# EAGLE design schematic (EAGLE 7.5.0)
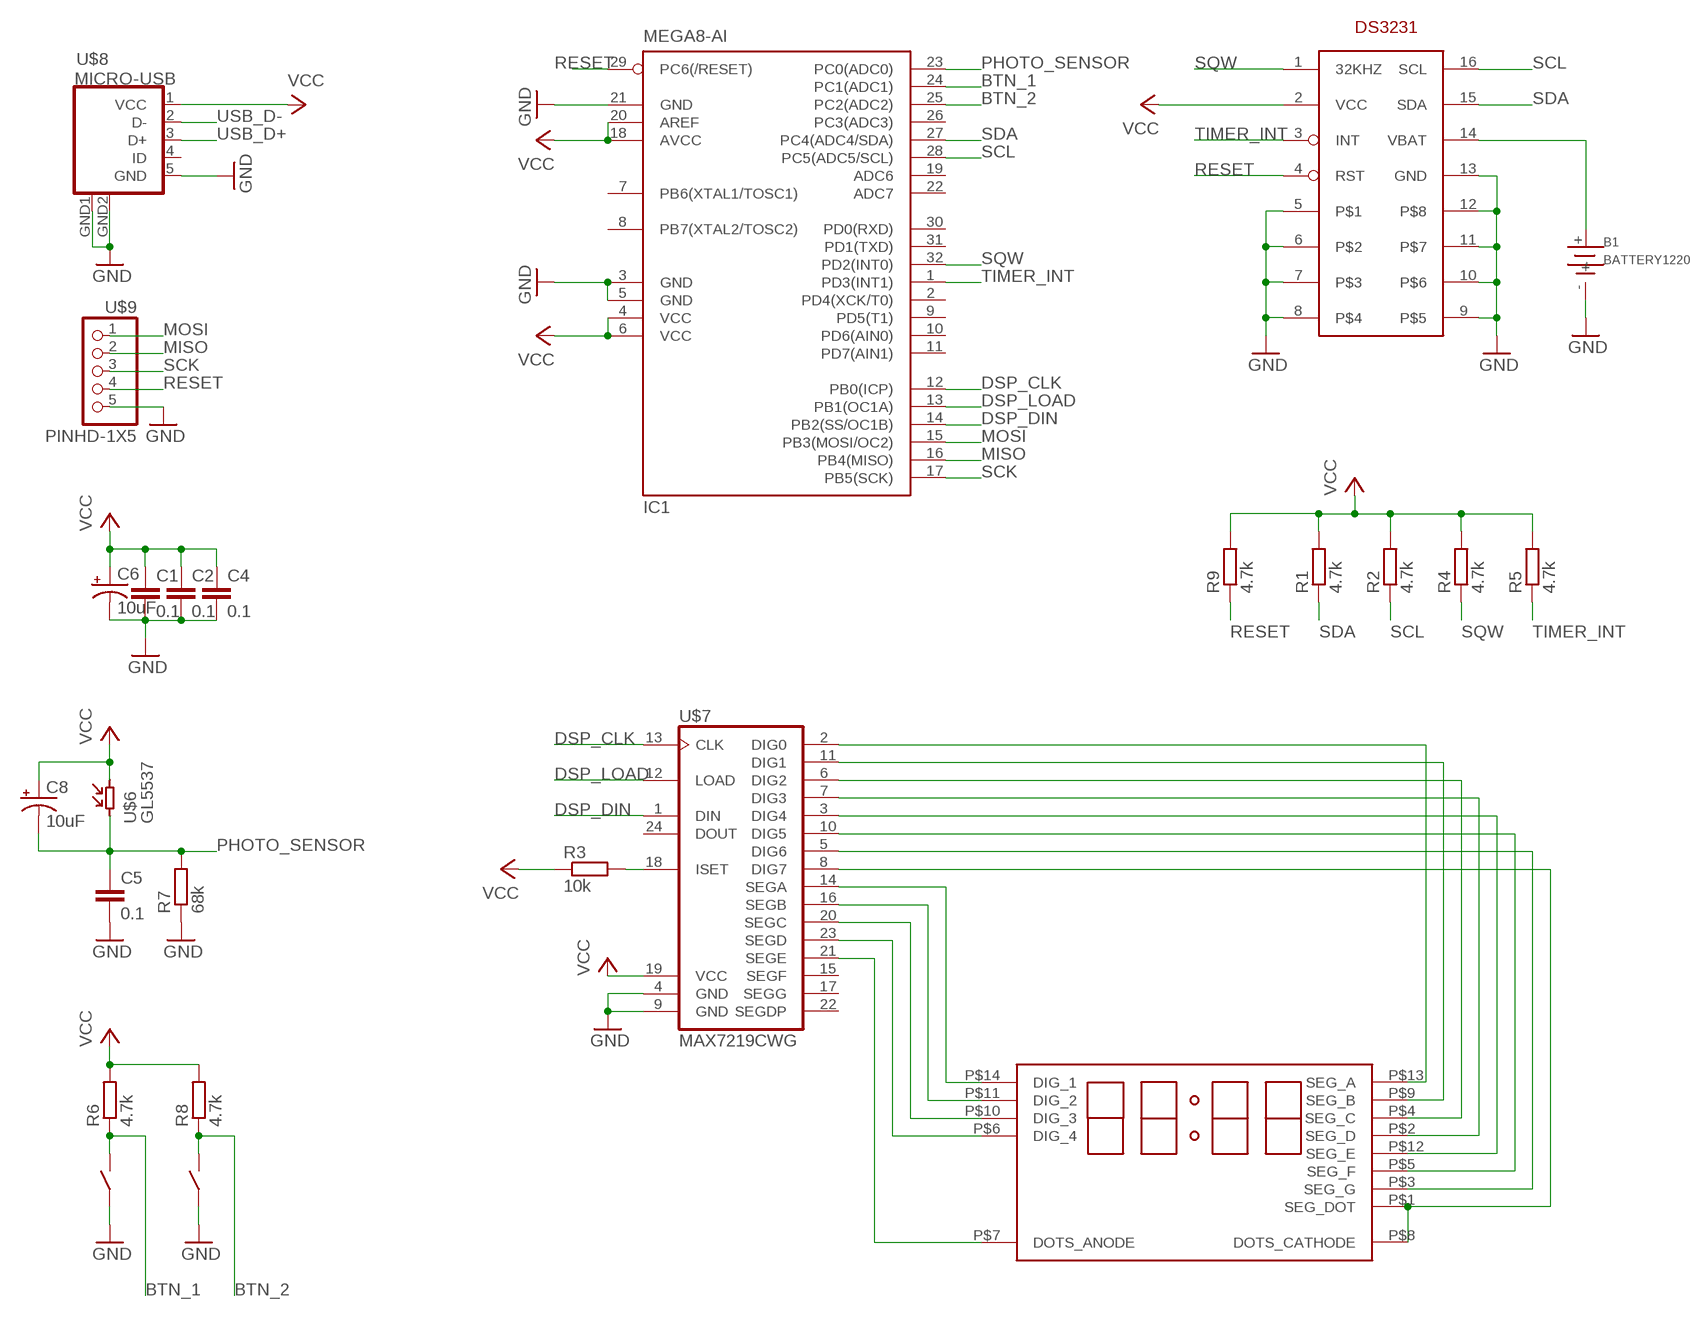
[diagram p0: schematic, sheet 1]

## Parts
B1  BATTERY1220  [1220-SMD]
C1  0.1  C-EUC0805  [C0805]
C2  0.1  C-EUC0805  [C0805]
C4  0.1  C-EUC0805  [C0805]
C5  0.1  C-EUC0805  [C0805]
C6  10uF  10UF-16V-10%(TANT)  [EIA3216]
C8  10uF  10UF-16V-10%(TANT)  [EIA3216]
IC1  MEGA8-AI  [TQFP32-08]
R1  4.7k  R-EU_R0805  [R0805]
R2  4.7k  R-EU_R0805  [R0805]
R3  10k  R-EU_R0805  [R0805]
R4  4.7k  R-EU_R0805  [R0805]
R5  4.7k  R-EU_R0805  [R0805]
R6  4.7k  R-EU_R0805  [R0805]
R7  68k  R-EU_R0805  [R0805]
R8  4.7k  R-EU_R0805  [R0805]
R9  4.7k  R-EU_R0805  [R0805]
U$1  LBT8402BW  [LBT8402]
U$2  DS3231WIDE  [SO16W]
U$3  IT1188E  [IT1188E]
U$4  IT1188E  [IT1188E]
U$6  GL5537  [GL55]
U$7  MAX7219CWG  [SO24L]
U$8  MICRO-USB  [MICRO-USB]
U$9  PINHD-1X5  [PLL1.27-1X5]

## Nets
BTN_1: IC1.24(PC1(ADC1)) R6.1 U$3.4
BTN_2: IC1.25(PC2(ADC2)) R8.1 U$4.4
DIG_1: U$1.P$14(DIG_1) U$7.14(SEGA)
DSP_CLK: IC1.12(PB0(ICP)) U$7.13(CLK)
DSP_DIN: IC1.14(PB2(SS/OC1B)) U$7.1(DIN)
DSP_LOAD: IC1.13(PB1(OC1A)) U$7.12(LOAD)
GND [power]: B1.- C1.2 C2.2 C4.2 C5.2 C6.C(-) IC1.3(GND) IC1.5(GND) IC1.21(GND) R7.1 U$2.5 U$2.6 U$2.7 U$2.8 U$2.9 U$2.10 U$2.11 U$2.12 U$2.13(GND) U$3.3 U$4.3 U$7.4(GND) U$7.9(GND) U$8.5(GND) U$8.GND1(GND) U$8.GND2(GND) U$9.5
MISO: IC1.16(PB4(MISO)) U$9.2
MOSI: IC1.15(PB3(MOSI/OC2)) U$9.1
N$1: R3.2 U$7.18(ISET)
N$2: U$1.P$11(DIG_2) U$7.16(SEGB)
N$3: U$1.P$10(DIG_3) U$7.20(SEGC)
N$4: U$1.P$6(DIG_4) U$7.23(SEGD)
N$5: U$1.P$7(DOTS_ANODE) U$7.21(SEGE)
N$6: U$1.P$13(SEG_A) U$7.2(DIG0)
N$7: U$1.P$9(SEG_B) U$7.11(DIG1)
N$8: U$1.P$4(SEG_C) U$7.6(DIG2)
N$9: U$1.P$2(SEG_D) U$7.7(DIG3)
N$10: U$1.P$12(SEG_E) U$7.3(DIG4)
N$11: U$1.P$5(SEG_F) U$7.10(DIG5)
N$12: U$1.P$3(SEG_G) U$7.5(DIG6)
N$13: U$1.P$1(SEG_DOT) U$1.P$8(DOTS_CATHODE) U$7.8(DIG7)
N$14: B1.+ U$2.14(VBAT)
PHOTO_SENSOR: C5.1 C8.C(-) IC1.23(PC0(ADC0)) R7.2 U$6.P$1
RESET: IC1.29(PC6(/RESET)) R9.1 U$2.4(RST) U$9.4
SCK: IC1.17(PB5(SCK)) U$9.3
SCL: IC1.28(PC5(ADC5/SCL)) R2.1 U$2.16(SCL)
SDA: IC1.27(PC4(ADC4/SDA)) R1.1 U$2.15(SDA)
SQW: IC1.32(PD2(INT0)) R4.1 U$2.1(32KHZ)
TIMER_INT: IC1.1(PD3(INT1)) R5.1 U$2.3(INT)
USB_D+: U$8.3(D+)
USB_D-: U$8.2(D-)
VCC [power]: C1.1 C2.1 C4.1 C6.A(+) C8.A(+) IC1.4(VCC) IC1.6(VCC) IC1.18(AVCC) IC1.20(AREF) R1.2 R2.2 R3.1 R4.2 R5.2 R6.2 R8.2 R9.2 U$2.2(VCC) U$6.P$2 U$7.19(VCC) U$8.1(VCC)
Unconnected: IC1.2(PD4(XCK/T0)) IC1.7(PB6(XTAL1/TOSC1)) IC1.8(PB7(XTAL2/TOSC2)) IC1.9(PD5(T1)) IC1.10(PD6(AIN0)) IC1.11(PD7(AIN1)) IC1.19(ADC6) IC1.22(ADC7) IC1.26(PC3(ADC3)) IC1.30(PD0(RXD)) IC1.31(PD1(TXD)) U$7.15(SEGF) U$7.17(SEGG) U$7.22(SEGDP) U$7.24(DOUT) U$8.4(ID)

## Library data of the parts
B1 = Battery&Holder:BATTERY
C1 C2 C4 C5 = resistor:C-EU: CAPACITOR, European symbol
C6 C8 = SparkFun-Capacitors:10UF-16V-10%(TANT): CAP-00811 1206/EIA-3216 Tantalum capacitor; PROD_ID: CAP-00811
IC1 = atmel:MEGA8: MICROCONTROLLER 8 Kbytes FLASH, 1 kbytes SRAM, 512 bytes EEPROM, USART, 6-channel 10 bit ADC, 2-channel 8 bit ADC Pin compatible with Atmega48, ATMega88, ATMega168 Source: avr.lbr; MPN: ATMEGA8-16AU; OC_FARNELL: 9171371; OC_NEWARK: 73M8863
R1-R9 = resistor:R-EU_: RESISTOR, European symbol
U$1 = lbt8402:LBT8402BW: LBT8402BW Clock LED Display Common Anode White Color 4 Digits 7 Segment 0.8inch
U$2 = DS3231:DS3231
U$3 U$4 = misc:IT1188E: IT1188E SMD Tact button
U$6 = misc:GL5537: GL5537 Photoresistor
U$7 = max7219:MAX7219CWG
U$8 = microusb:MICRO-USB: Micro USB B connector
U$9 = PLL:PINHD-1X5: Pin Header 1.27 5x1

## Net classes
1 power: width 0.5 mm

## Board
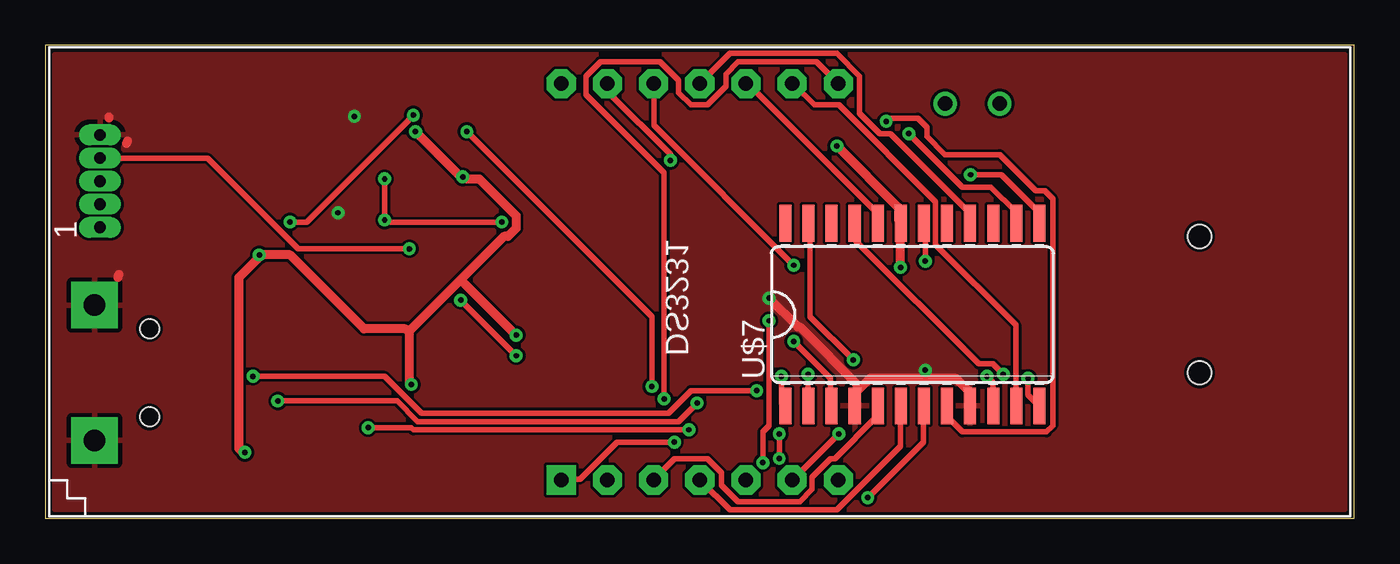
[diagram p1: board, top side]
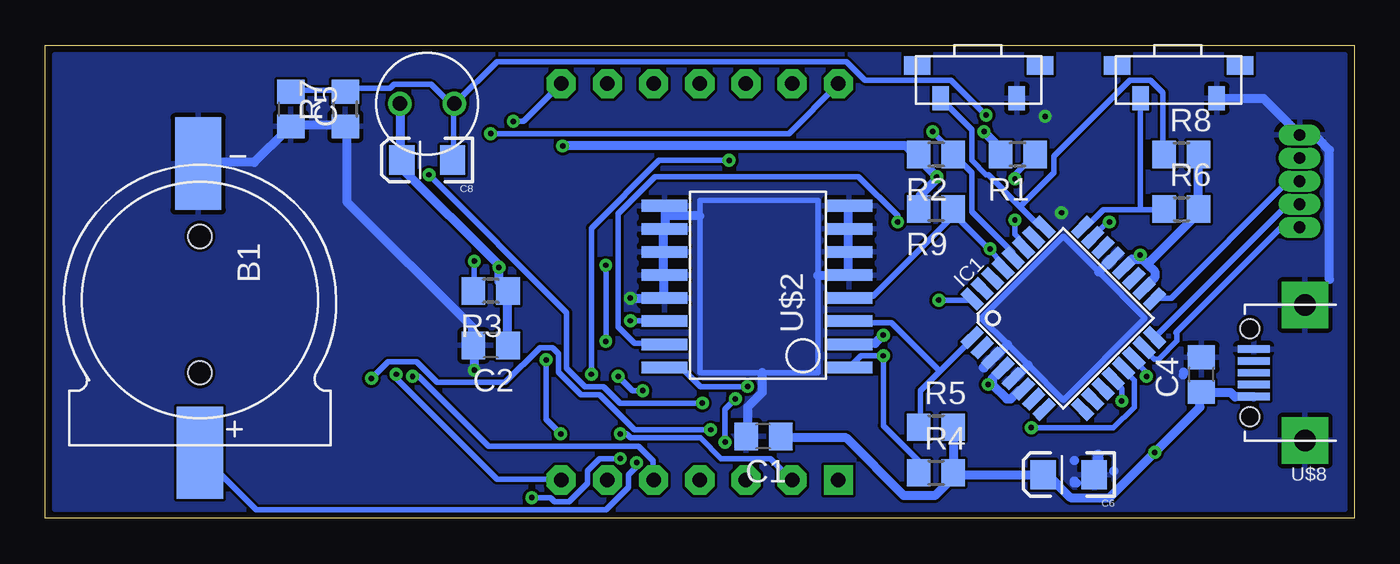
[diagram p2: board, bottom side, seen from below]

Size 72 x 26 mm. Coordinates in mm from the lower left corner, seen from the top.
Outline: 0,0 72,0 72,26 0,26 0,0
Copper layers (1*16): Top 0.035mm / dielectric 1.6mm / Bottom 0.035mm
Design rules "hqew": minimum track width 0.3mm, minimum drill 0.3mm, track to track 6mil, track to pad 6mil, pad to pad 6mil, via to via 6mil, smd to smd 6mil, copper to edge 0.2mm, drill to drill 8mil, minimum pad ring 10mil, minimum via ring 8mil, stop-mask expansion 4mil, vias tented up to drill 0mil, thermal gap 10mil
bKeepout: area 11.5,6.5 to 20.5,15.5; area 29.5,8 to 36,17.5

### Footprints (pad centres in the part's own frame; a part is rotated, then mirrored left to right if it is on the bottom)
1220-SMD = smd 5.08 x 2.54: + 8.4,0; - -7.5,-0.1 | hole 1.3: 4,0; -3.5,0
C0805 = smd 1.3 x 1.5: 1 -0.95,0; 2 0.95,0
EIA3216 = smd 1.4 x 1.6: A 1.4,0; C -1.4,0
TQFP32-08 = smd 1.27 x 0.559: 1 -4.293,2.8; 2 -4.293,2; 3 -4.293,1.2; 4 -4.293,0.4; 5 -4.293,-0.4; 6 -4.293,-1.2; 7 -4.293,-2; 8 -4.293,-2.8; 17 4.293,-2.8; 18 4.293,-2; 19 4.293,-1.2; 20 4.293,-0.4; 21 4.293,0.4; 22 4.293,1.2; 23 4.293,2; 24 4.293,2.8 | smd 0.559 x 1.27: 9 -2.8,-4.293; 10 -2,-4.293; 11 -1.2,-4.293; 12 -0.4,-4.293; 13 0.4,-4.293; 14 1.2,-4.293; 15 2,-4.293; 16 2.8,-4.293; 25 2.8,4.293; 26 2,4.293; 27 1.2,4.293; 28 0.4,4.293; 29 -0.4,4.293; 30 -1.2,4.293; 31 -2,4.293; 32 -2.8,4.293
R0805 = smd 1.3 x 1.5: 1 -0.95,0; 2 0.95,0
LBT8402 = drill 0.8 pad 1.6 square: P$1 28.18,2 | drill 0.8 pad 1.6 octagon: P$2 30.72,2; P$3 33.26,2; P$4 35.8,2; P$5 38.34,2; P$6 40.88,2; P$7 43.42,2; P$8 43.42,23.8; P$9 40.88,23.8; P$10 38.34,23.8; P$11 35.8,23.8; P$12 33.26,23.8; P$13 30.72,23.8; P$14 28.18,23.8
SO16W = smd 0.635 x 2.54: 1 0.635,-1.27; 2 1.905,-1.27; 3 3.175,-1.27; 4 4.445,-1.27; 5 5.715,-1.27; 6 6.985,-1.27; 7 8.255,-1.27; 8 9.525,-1.27; 9 9.525,8.89; 10 8.255,8.89; 11 6.985,8.89; 12 5.715,8.89; 13 4.445,8.89; 14 3.175,8.89; 15 1.905,8.89; 16 0.635,8.89
IT1188E = smd 1.45 x 1: 1 -0.72,-0.9; 2 6.04,-0.9 | smd 0.9 x 1.3: 3 0.56,0.9; 4 4.74,0.9
GL55 = drill 0.8: P$1 -1.5,0; P$2 1.5,0
SO24L = smd 0.66 x 2.032: 1 -6.985,-5.029; 2 -5.715,-5.029; 3 -4.445,-5.029; 4 -3.175,-5.029; 5 -1.905,-5.029; 6 -0.635,-5.029; 7 0.635,-5.029; 8 1.905,-5.029; 9 3.175,-5.029; 10 4.445,-5.029; 11 5.715,-5.029; 12 6.985,-5.029; 13 6.985,5.029; 14 5.715,5.029; 15 4.445,5.029; 16 3.175,5.029; 17 1.905,5.029; 18 0.635,5.029; 19 -0.635,5.029; 20 -1.905,5.029; 21 -3.175,5.029; 22 -4.445,5.029; 23 -5.715,5.029; 24 -6.985,5.029
MICRO-USB = smd 0.4 x 1.75: 1 -1.3,4.525; 2 -0.65,4.525; 3 0,4.525; 4 0.65,4.525; 5 1.3,4.525 | drill 1.2 pad 2.54 square: GND1 -3.725,1.7; GND2 3.725,1.7 | hole 1.05: -2.425,4.73; 2.425,4.73
PLL1.27-1X5 = drill 0.65 pad 1.016 long: 1 0,0; 2 1.27,0; 3 2.54,0; 4 3.81,0; 5 5.08,0

### Placement (x,y rotation side)
B1  63.5,12 270 bottom
C1  32.5,4.5 180 bottom
C2  47.5,9.5 180 bottom
C4  8.4,7.9 90 bottom
C5  58.5,22.5 270 bottom
C6  15.7,2.4 180 bottom
C8  51,19.7 180 bottom
IC1  16,11 45 bottom
R1  18.5,20 180 bottom
R2  23,20 180 bottom
R3  47.5,12.5 180 bottom
R4  23,2.5 0 bottom
R5  23,5 0 bottom
R6  9.5,17 0 bottom
R7  55.5,22.5 90 bottom
R8  9.5,20 0 bottom
R9  23,17 180 bottom
U$1  0.2,0.1 0 top
U$2  29.05,7.66 90 bottom
U$3  7,24 180 bottom
U$4  18,24 180 bottom
U$6  51,22.8 180 bottom
U$7  47.7,11.2 0 top
U$8  1,8 90 bottom
U$9  3,16 90 top

### Tracks (layer width: path | path; a pad name or v marks a point on that pad's centre or on a via)
BTN_1
  Bottom 0.3: 11.76,16.96 10.52,16.96 R6.1 | 11.76,16.96 13.8,16.96 14.7,16.06 14.93,16.06 IC1.24 | 11.76,16.96 11.76,23.07 U$3.4
BTN_2
  Bottom 0.3: 18.38,17.14 20.13,18.89 20.25,18.89 21.04,19.68 21.04,21.38 22.73,23.07 U$4.4 | 18.38,17.14 17.3,16.06 17.08,16.06 IC1.25 | 18.38,17.14 16.51,19 16.51,19.91 12.33,24.09 11.2,24.09 10.52,23.41 10.52,20.02 R8.1
DIG_1  (via drill 0.3)
  Top 0.3: v47.5,21.15 50.44,18.21 52.03,18.21 53.38,16.85 53.38,16.29 U$7.14
  Bottom 0.3: v47.5,21.15 31.1,21.15 28.39,23.86 U$1.P$14
DSP_CLK  (via drill 0.3)
  Top 0.3: v12.78,6.45 19.34,6.45 20.47,5.32 34.84,5.32 v35.85,6.33 | v50.9,18.89 52.59,18.89 54.63,16.85 54.63,16.29 U$7.13
  Bottom 0.3: v12.78,6.45 12.78,7.12 13.23,7.58 IC1.12 | v35.85,6.33 40.38,6.33 41.28,7.24 42.3,7.24 43.32,8.26 43.32,11.31 v50.9,18.89
DSP_DIN  (via drill 0.3)
  Top 0.3: v11.42,7.8 18.66,7.8 20.7,5.77 34.27,5.77 35.51,7.01 v39.13,7.01 | v40.49,7.8 40.49,6.33 40.6,6.22 U$7.1
  Bottom 0.3: v11.42,7.8 11.42,8.03 12.1,8.71 IC1.14 | v39.13,7.01 39.7,7.01 v40.49,7.8
DSP_LOAD  (via drill 0.3)
  Top 0.3: v17.76,4.98 20.13,4.98 20.25,4.86 v35.4,4.86 | v54.06,7.69 54.06,6.79 54.63,6.22 U$7.12
  Bottom 0.3: v17.76,4.98 13.23,4.98 12.1,6.11 12.1,7.58 12.67,8.14 IC1.13 | v35.4,4.86 39.59,4.86 41.51,6.79 42.53,6.79 43.77,8.03 43.77,9.05 44.11,9.39 44.79,9.39 46.71,7.46 50.44,7.46 51.57,8.6 53.16,8.6 v54.06,7.69
GND  (via drill 0.3)
  Top 0.5: 44.84,7.18 45.35,7.69 48.41,7.69 | 44.84,7.18 44.56,6.9 44.56,6.22 U$7.4 | 48.41,7.69 50.1,7.69 50.78,7.01 50.78,6.22 U$7.9 | v48.41,8.14 48.41,7.69 | v39.81,12.1 41.4,10.52 41.51,10.52 44.84,7.18 | 3.5,22 3.5,22.06 | 4,13.25 4.04,13.39 | 4.5,20.75 4.45,20.61
  Bottom 0.3: 29.5,17.5 36,17.5 36,16.63 36,8 32.57,8 29.5,8 29.5,13.35 29.5,17.5 | 16,15.5 20.5,11 19.06,9.56 17.93,8.43 16,6.5 11.5,11 14.05,13.55 16,15.5
  Bottom 0.5: U$3.3 7.46,23.07 4.98,23.07 3.05,21.15 U$9.5 2.83,20.92 2.04,20.92 1.36,20.25 1.36,13.12 | 14.05,13.55 13.35,14.25 IC1.21 | 17.93,8.43 18.66,7.69 IC1.5 19,7.46 18.98,7.45 | 19.06,9.56 19.79,8.82 IC1.3 | 2.6,11.88 U$8.GND2 | 37.89,16.63 37.89,16.17 U$2.10 38,15.83 38,14.82 U$2.11 38,14.59 38,13.57 U$2.12 38,13.35 38,12.21 U$2.13 38.23,12.1 v39.81,12.1 | 37.89,16.63 37.89,17.08 U$2.9 | 32.57,8 32.57,6.9 33.36,6.11 33.36,4.52 C1.2 | 29.5,13.35 27.82,13.35 U$2.5 27.82,13.57 27.82,14.59 U$2.6 27.82,14.82 27.82,15.83 U$2.7 27.82,16.06 27.82,17.08 U$2.8 | 36,16.63 37.89,16.63 | v48.41,8.14 48.41,9.27 C2.2 48.52,9.5 48.52,10.52 55.42,17.42 55.42,21.49 R7.1 55.76,21.6 58.47,21.6 C5.2 58.7,21.38 60.51,19.57 63.56,19.57 B1.- | 14.02,3.28 14.15,3.28 | 15.27,1.92 15.4,1.92 | 8.94,9.05 8.94,9 | 13.23,2.6 13.2,2.6 | C6.C 14.14,2.15 14.15,2.25 | 20.25,8.48 20.23,8.47 | 15.38,2.04 15.4,2.04 | 9.39,8.03 9.4,7.88 | 15.38,3.17 15.4,3.17 | 14.02,3.51 14.15,3.51 | 20.36,8.26 20.4,8.3
  other vias: 17,22.1 16.1,16.8
  pour Bottom: 0.5,25.5 71.5,25.5 71.5,0.5 0.5,0.5
  pour Top: 0.5,25.5 71.5,25.5 71.5,0.5 0.5,0.5
MISO
  Bottom 0.3: IC1.16 10.97,9.95 3.73,17.19 3.05,17.19 U$9.2
MOSI
  Bottom 0.3: 3.05,16.06 U$9.1 4,16 9.75,10.25 | 9.8,10.2 9.75,10.25 | 9.75,10.25 9.75,9.75 10.75,8.75 11,8.75 11.5,9.25 IC1.15
N$1  (via drill 0.3)
  Top 0.3: v48.41,14.14 48.41,16.17 U$7.18
  Bottom 0.3: v48.41,14.14 48.41,12.55 R3.2
N$2
  Top 0.3: U$7.16 50.78,16.29 50.78,16.85 46.48,21.15 45.92,21.15 44.79,22.28 44.79,24.32 43.54,25.56 37.66,25.56 36.08,23.98 U$1.P$11
N$3
  Top 0.3: U$7.20 45.69,16.29 45.69,16.85 38.57,23.98 U$1.P$10
N$4  (via drill 0.3)
  Top 0.3: v44.45,8.71 42.07,11.08 42.07,16.17 U$7.23 | v43.66,4.64 41.17,2.15 U$1.P$6
  Bottom 0.3: v44.45,8.71 44.45,5.43 v43.66,4.64
N$5  (via drill 0.3)
  Top 0.3: v52.7,7.92 52.14,8.48 51.35,8.48 44.56,15.27 44.56,16.17 U$7.21
  Bottom 0.3: v52.7,7.92 52.7,7.69 47.16,2.15 43.66,2.15 U$1.P$7
N$6  (via drill 0.3)
  Top 0.3: v41.96,7.92 41.96,6.22 U$7.2 | v34.38,19.68 34.38,20.02 30.99,23.41 30.99,23.86 U$1.P$13
  Bottom 0.3: v41.96,7.92 41.96,15.95 38.23,19.68 v34.38,19.68
N$7
  Top 0.3: U$7.11 53.38,6.22 53.38,10.63 48.97,15.04 48.97,17.42 43.66,22.73 42.3,22.73 41.17,23.86 U$1.P$9
N$8
  Top 0.3: U$7.6 47.05,6.11 47.05,3.96 43.54,0.45 37.66,0.45 36.08,2.04 U$1.P$4
N$9  (via drill 0.3)
  Top 0.3: v45.24,1.13 48.29,4.18 48.29,6.11 U$7.7 | v40.38,4.64 v40.38,3.28
  Bottom 0.3: v45.24,1.13 44.22,1.13 44,0.91 43.2,0.91 42.19,1.92 42.19,2.6 41.51,3.28 v40.38,3.28 | v40.38,4.64 40.04,4.64 39.81,4.41 35.97,4.41 34.84,3.28 32.12,3.28 30.99,2.15 U$1.P$2
N$10  (via drill 0.3)
  Top 0.3: v41.17,9.73 43.2,7.69 43.2,6.22 U$7.3 | v41.17,13.91 33.48,21.6 33.48,23.86 U$1.P$12
  Bottom 0.3: v41.17,13.91 v41.17,9.73
N$11  (via drill 0.3)
  Top 0.3: v51.8,7.8 52.14,7.46 52.14,6.22 U$7.10
  Bottom 0.3: v51.8,7.8 51.46,7.8 47.62,3.96 39.36,3.96 38.57,3.17 38.57,2.15 U$1.P$5
N$12
  Top 0.3: U$7.5 45.69,6.11 45.69,5.54 43.43,3.28 43.2,3.28 42.19,2.26 42.19,1.58 41.51,0.91 38.12,0.91 37.21,1.81 37.21,2.49 36.42,3.28 34.61,3.28 33.48,2.15 U$1.P$3
N$13  (via drill 0.3)
  Top 0.3: U$7.8 49.65,6.11 49.65,5.54 50.44,4.75 55.08,4.75 55.42,5.09 55.42,17.58 55,18 54.5,18 52.5,20 49.5,20 48.5,21 48.5,21.5 48,22 46.43,22 v46.26,21.83 | v34.61,4.18 31.44,4.18 29.41,2.15 28.39,2.15 U$1.P$1 | v34.04,6.56 34.04,19 29.75,23.3 29.75,24.32 30.54,25.11 33.82,25.11 34.84,24.09 34.84,23.41 35.51,22.73 36.42,22.73 37.44,23.75 37.44,24.43 38.12,25.11 42.41,25.11 43.54,23.98 U$1.P$8
  Bottom 0.3: v46.26,21.83 45.69,21.83 43.66,23.86 U$1.P$8 | v34.61,4.18 34.61,5.99 v34.04,6.56
N$14  (via drill 0.3)
  Top 0.3: v39.81,10.86 39.81,5.09 39.47,4.75 v39.47,3.05
  Bottom 0.3: v39.81,10.86 38,10.86 U$2.14 | v39.47,3.05 39.47,2.83 39.92,2.38 39.92,1.7 41.17,0.45 60.4,0.45 63.45,3.51 B1.+
PHOTO_SENSOR  (via drill 0.3)
  Top 0.3: v13.46,16.29 14.36,16.29 v20.25,22.17
  Bottom 0.3: C5.1 58.47,23.52 55.53,23.52 R7.2 55.42,23.64 53.04,23.64 52.82,23.86 50.78,23.86 49.65,22.73 U$6.P$1 | v13.46,16.29 13.57,16.29 14.36,15.49 IC1.23 | v20.25,22.17 22.17,24.09 26.92,24.09 27.94,25.11 47.16,25.11 49.42,22.85 U$6.P$1 | C8.C 49.54,19.79 49.54,22.73 U$6.P$1
RESET  (via drill 0.3)
  Top 0.3: v20.02,14.82 13.91,14.82 8.94,19.79 3.05,19.79 U$9.4
  Bottom 0.3: 20.07,14.76 21.94,16.63 21.94,16.96 R9.1 22.05,16.63 26.46,12.21 27.71,12.21 U$2.4 | 20.07,14.76 19.34,14.02 19.34,13.8 IC1.29 | v20.02,14.82 20.07,14.76
SCK
  Bottom 0.3: IC1.17 10.97,12.1 10.07,12.1 3.73,18.43 3.05,18.43 U$9.3
SCL  (via drill 0.3)
  Top 0.3: v33.36,7.24 33.36,11.08 v23.19,21.26
  Bottom 0.3: IC1.28 18.77,14.36 18.77,14.59 21.04,16.85 21.04,19 21.94,19.91 R2.1 22.05,20.13 v23.19,21.26 | v33.36,7.24 35.97,7.24 36.98,8.26 37.89,8.26 U$2.16
SDA  (via drill 0.3)
  Top 0.3: v18.66,18.66 v18.66,16.4 18.66,16.29 v25.11,16.29
  Bottom 0.3: v18.66,16.4 18.66,15.61 18.21,15.15 18.21,14.93 IC1.27 | v18.66,18.66 18.66,18.89 17.64,19.91 R1.1 | v25.11,16.29 25.11,16.63 27.26,18.77 38.45,18.77 40.49,16.74 40.49,10.52 39.59,9.61 38,9.61 U$2.15
SQW  (via drill 0.3)
  Top 0.3: v25.9,8.94 v22.85,11.99
  Bottom 0.3: v22.85,11.99 21.04,11.99 IC1.32 | U$2.1 27.71,8.37 27.14,8.94 v25.9,8.94 25.9,5.09 23.98,3.17 23.98,2.6 R4.1
TIMER_INT
  Bottom 0.3: 22.79,8.09 23.86,7.01 23.86,5.09 R5.1 | 22.79,8.09 21.04,9.84 IC1.1 | 22.79,8.09 25.45,10.74 27.71,10.74 U$2.3
VCC  (via drill 0.3)
  Top 0.5: v47.05,13.8 47.05,16.17 U$7.19 46.94,16.4 46.94,17.08 v43.54,20.47 | v20.36,21.26 22.85,18.77 v22.96,18.77 23.19,18.66 23.86,18.66 25.9,16.63 25.9,15.95 25.45,15.49 25.22,15.49 22.85,13.12 | v20.13,7.35 20.02,7.35 20.02,10.29 | 22.85,13.12 20.02,10.29 | 22.85,13.12 v25.9,10.07 | 20.02,10.29 19.79,10.4 17.53,10.4 13.46,14.48 v11.76,14.48 11.65,14.25 10.63,13.23 10.63,3.85 10.86,3.62 v10.97,3.62
  Bottom 0.5: U$8.1 5.54,6.67 6.56,6.67 6.79,6.9 8.37,6.9 C4.1 8.48,6.67 8.48,6.11 v10.97,3.62 13.46,1.13 15.61,1.13 16.85,2.38 C6.A 17.19,2.38 21.83,2.38 R4.2 | R4.2 22.05,2.6 22.05,4.98 R5.2 | C1.1 31.44,4.41 27.94,4.41 24.77,1.24 23.07,1.24 22.05,2.26 R4.2 | U$6.P$2 52.48,22.73 52.48,19.79 C8.A 52.37,19.45 52.37,19.23 47.16,14.02 v47.05,13.8 47.05,13.01 46.71,12.67 R3.1 46.6,12.44 46.6,9.5 C2.1 | R8.2 8.6,19.91 8.6,17.08 R6.2 8.48,16.85 11.37,13.97 | v43.54,20.47 24.66,20.47 24.2,20.02 R2.2 23.98,19.79 v22.96,18.77 23.07,18.55 23.86,17.76 23.86,17.08 R9.2 | 11.65,14.25 11.37,13.97 | 11.37,13.97 10.97,13.57 10.97,13.23 11.54,12.67 IC1.18 | 11.65,14.25 12.21,14.25 12.67,13.8 IC1.20 | 19.91,7.35 19.11,6.56 18.89,6.56 18.43,7.01 18.21,7.01 IC1.6 | 19.91,7.35 19.91,7.69 19.34,8.26 IC1.4 | v20.36,21.26 19.45,20.36 19.45,20.02 R1.2 | v20.13,7.35 19.91,7.35 | v25.9,10.07 26.35,9.61 27.71,9.61 U$2.2 | v11.76,14.48 11.65,14.25